# Altium schematic sheet jn5168_blk.SchDoc
size A4; Date: 1/11/2016; Engineer: JBayalas; DocumentNumber: 9; Revision: V2.0; SheetNumber: 9; SheetTotal: 10
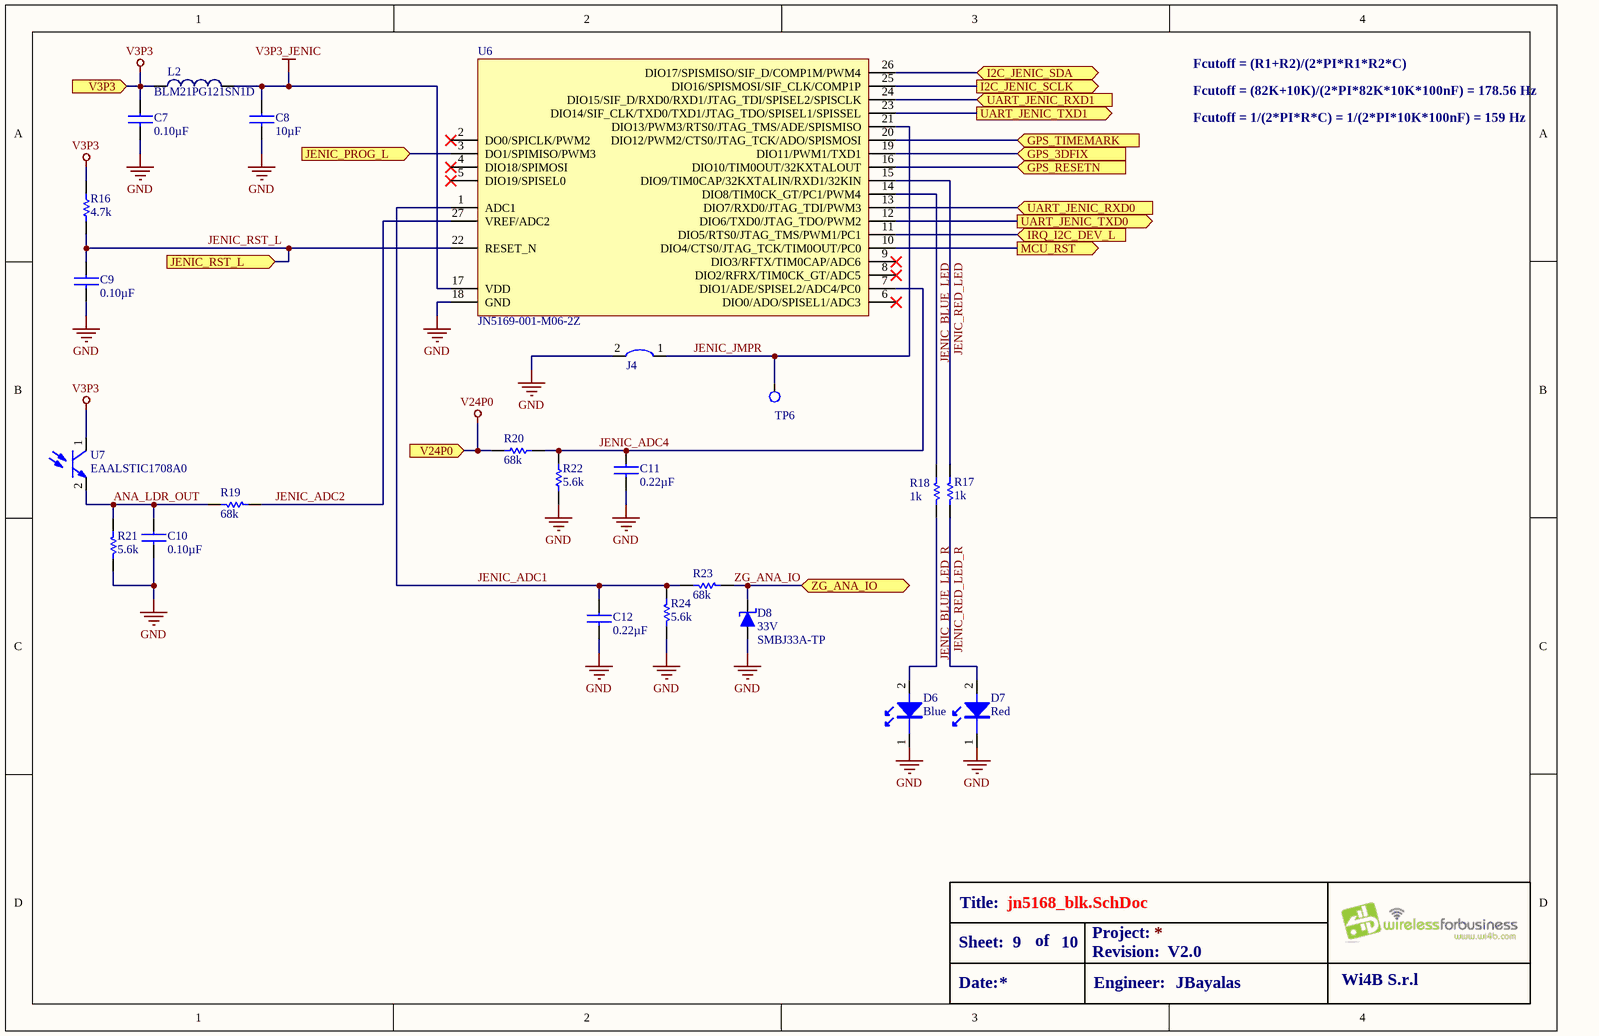
[diagram p0: jn5168_blk.SchDoc]

## Parts
C7  value 0.10µF  [C0402]  (hidden comment: GRM155R71H104ME14D)
C8  value 10µF  [C1206]  (hidden comment: GRM31CR71C106KAC7L)
C9  value 0.10µF  [C0402]  (hidden comment: GRM155R71H104ME14D)
C10  value 0.10µF  [C0402]  (hidden comment: GRM155R71H104ME14D)
C11  value 0.22µF  [C0603]  (hidden comment: GCM188R71H224KA64D)
C12  value 0.22µF  [C0603]  (hidden comment: GCM188R71H224KA64D)
D6  value Blue  [LED0402(BLUE)]  (hidden comment: VLMB1500-GS08)
D7  value Red  [LED0402(RED)]  (hidden comment: VLMS1500-GS08)
D8  RATING: 33V  [DO-214AA, SMB]  (hidden comment: SMBJ33A-TP)
J4  0603 Jumper  [0603 Jumper]  (value not drawn)
L2  BLM21PG121SN1D  [0805 INDUCTOR]
R16  value 4.7k  [R0402]  (hidden comment: MCS04020C4701FE000)
R17  value 1k  [R0402]  (hidden comment: MCS04020C1001FE000)
R18  value 1k  [R0402]  (hidden comment: MCS04020C1001FE000)
R19  value 68k  [R0603]  (hidden comment: ERA-3AEB683V)
R20  value 68k  [R0603]  (hidden comment: *)
R21  value 5.6k  [R0603]  (hidden comment: ERA-3AEB562V)
R22  value 5.6k  [R0603]  (hidden comment: *)
R23  value 68k  [R0603]  (hidden comment: ERA-3AEB683V)
R24  value 5.6k  [R0603]  (hidden comment: ERA-3AEB562V)
TP6  Test Point_2mm  [Test Point 2mm]  (value not drawn)
U6  JN5169-001-M06-2Z  [JN5168-001-M06Z]
U7  EAALSTIC1708A0  [EAALSTIC1708A0]

## Ports
GPS_3DFIX (in), GPS_RESETN (in), GPS_TIMEMARK (in), I2C_JENIC_SCLK (out), I2C_JENIC_SDA (bidir), IRQ_I2C_DEV_L (in), JENIC_PROG_L (in), JENIC_RST_L (in), MCU_RST (out), UART_JENIC_RXD0 (in), UART_JENIC_RXD1 (in), UART_JENIC_TXD0 (out), UART_JENIC_TXD1 (out), V3P3 (in), V24P0 (in), ZG_ANA_IO (bidir)

## Nets
GND: C7.2 C8.2 C9.2 C10.2 C11.2 C12.2 D6.1 D7.1 D8.2(A) J4.2 R21.1 R22.1 R24.1 U6.18(GND)
V3P3: C7.1 L2.2 R16.2 U7.1(COLLECTOR) ; port V3P3
V3P3_JENIC: C8.1 L2.1 U6.17(VDD)
V24P0: R20.1 ; port V24P0
ANA_LDR_OUT: C10.1 R19.2 R21.2 U7.2(EMITTER)
GPS_3DFIX: U6.19(DIO11/PWM1/TXD1) ; port GPS_3DFIX
GPS_RESETN: U6.16(DIO10/TIM0OUT/32KXTALOUT) ; port GPS_RESETN
GPS_TIMEMARK: U6.20(DIO12/PWM2/CTS0/JTAG_TCK/ADO/SPISMOSI) ; port GPS_TIMEMARK
I2C_JENIC_SCLK: U6.25(DIO16/SPISMOSI/SIF_CLK/COMP1P) ; port I2C_JENIC_SCLK
I2C_JENIC_SDA: U6.26(DIO17/SPISMISO/SIF_D/COMP1M/PWM4) ; port I2C_JENIC_SDA
IRQ_I2C_DEV_L: U6.11(DIO5/RTS0/JTAG_TMS/PWM1/PC1) ; port IRQ_I2C_DEV_L
JENIC_ADC1: C12.1 R23.2 R24.2 U6.1(ADC1)
JENIC_ADC2: R19.1 U6.27(VREF/ADC2)
JENIC_ADC4: C11.1 R20.2 R22.2 U6.7(DIO1/ADE/SPISEL2/ADC4/PC0)
JENIC_BLUE_LED: R18.2 U6.14(DIO8/TIM0CK_GT/PC1/PWM4)
JENIC_BLUE_LED_R: D6.2 R18.1
JENIC_JMPR: J4.1 TP6.1 U6.21(DIO13/PWM3/RTS0/JTAG_TMS/ADE/SPISMISO)
JENIC_PROG_L: U6.3(DO1/SPIMISO/PWM3) ; port JENIC_PROG_L
JENIC_RED_LED: R17.2 U6.15(DIO9/TIM0CAP/32KXTALIN/RXD1/32KIN)
JENIC_RED_LED_R: D7.2 R17.1
JENIC_RST_L: C9.1 R16.1 U6.22(RESET_N) ; port JENIC_RST_L
MCU_RST: U6.10(DIO4/CTS0/JTAG_TCK/TIM0OUT/PC0) ; port MCU_RST
UART_JENIC_RXD0: U6.13(DIO7/RXD0/JTAG_TDI/PWM3) ; port UART_JENIC_RXD0
UART_JENIC_RXD1: U6.24(DIO15/SIF_D/RXD0/RXD1/JTAG_TDI/SPISEL2/SPISCLK) ; port UART_JENIC_RXD1
UART_JENIC_TXD0: U6.12(DIO6/TXD0/JTAG_TDO/PWM2) ; port UART_JENIC_TXD0
UART_JENIC_TXD1: U6.23(DIO14/SIF_CLK/TXD0/TXD1/JTAG_TDO/SPISEL1/SPISSEL) ; port UART_JENIC_TXD1
ZG_ANA_IO: D8.1(K) R23.1 ; port ZG_ANA_IO

Not connected (* = marked no-connect by the designer): U6 2(DO0/SPICLK/PWM2)* 4(DIO18/SPIMOSI)* 5(DIO19/SPISEL0)* 6(DIO0/ADO/SPISEL1/ADC3)* 8(DIO2/RFRX/TIM0CK_GT/ADC5)* 9(DIO3/RFTX/TIM0CAP/ADC6)*

## Notes on the sheet
- Fcutoff = (R1+R2)/(2*PI*R1*R2*C)
- Fcutoff = (82K+10K)/(2*PI*82K*10K*100nF) = 178.56 Hz
- Fcutoff = 1/(2*PI*R*C) = 1/(2*PI*10K*100nF) = 159 Hz
- Title:
- Sheet:
- Date:
- of
- Project:
- Revision:
- Engineer:
- Wi4B S.r.l

## Library data of the parts
C7 C9 C10 = GRM155R71H104ME14D: CAP CER 0.1UF 50V X7R 0402; MFT: Murata Electronics North America; TYPE: SMD; FUNCTION: JN5168; MPN: GRM155R71H104ME14D; RATING: 50V; DNP: *
C8 = GRM31CR71C106KAC7L: CAP CER 10UF 16V X7R 1206; MFT: Murata Electronics North America; TYPE: SMD; FUNCTION: JN5168; MPN: GRM31CR71C106KAC7L; RATING: 16V; DNP: *
C11 C12 = GCM188R71H224KA64D: CAP CER 0.22UF 50V X7R 0603; MFT: Murata Electronics North America; TYPE: Surface Mount, MLCC; FUNCTION: analog inputs; MPN: GCM188R71H224KA64D; RATING: 50V
D6 = VLMB1500-GS08: LED BLUE 0402 SMD; MFT: Vishay Semiconductor Opto Division; FUNCTION: Top; MPN: VLMB1500-GS08; TYPE: SMD; RATING: *; DNP: *
D7 = VLMS1500-GS08: LED RED 0402 SMD; MFT: Vishay Semiconductor Opto Division; FUNCTION: Top; MPN: VLMS1500-GS08; TYPE: SMD; RATING: *; DNP: *
D8 = SMBJ33A-TP: TVS DIODE 33VWM 53.3VC SMB; MFT: Micro Commercial Co; FUNCTION: analog inputs; TYPE: Surface Mount; VALUE: SMBJ33A-TP; MPN: SMBJ33A-TP
J4 = 0603 Jumper: FUNCTION: JN5168
L2 = BLM21PG121SN1D: FERRITE CHIP 120 OHM 0805; MFT: Murata Electronics North America; RATING: 3A; TYPE: Surface Mount; VALUE: 120 Ohm; FUNCTION: JN5168; MPN: BLM21PG121SN1D
R16 = MCS04020C4701FE000: RES SMD 4.7K OHM 1% 1/10W 0402; MFT: Vishay Beyschlag; FUNCTION: JN5168; MPN: MCS04020C4701FE000; TYPE: SMD; RATING: 1/10W; DNP: *
R17 R18 = MCS04020C1001FE000: RES SMD 1K OHM 1% 1/10W 0402; MFT: Vishay Beyschlag; FUNCTION: Top; MPN: MCS04020C1001FE000; TYPE: SMD; RATING: 1/10W; DNP: *
R19 R23 = ERA-3AEB683V: RES SMD 68K OHM 0.1% 1/10W 0603; MFT: Panasonic Electronic Components; FUNCTION: analog inputs; MPN: ERA-3AEB683V; TYPE: SMD; RATING: 1/10W; DNP: *
R20 = ERA-3AEB683V: RES SMD 68K OHM 0.1% 1/10W 0603; MFT: Panasonic Electronic Components; MPN: ERA-3AEB683V; TYPE: SMD; RATING: 1/10W; LOAD: *
R21 R24 = ERA-3AEB562V: RES SMD 5.6K OHM 0.1% 1/10W 0603; MFT: Panasonic Electronic Components; FUNCTION: analog inputs; MPN: ERA-3AEB562V; TYPE: SMD; RATING: 1/10W; DNP: *
R22 = ERA-3AEB562V: RES SMD 5.6K OHM 0.1% 1/10W 0603; MFT: Panasonic Electronic Components; MPN: ERA-3AEB562V; TYPE: SMD; RATING: 1/10W; LOAD: *
TP6 = Test Point_2mm: Test Point 2mm
U6 = JN5169-001-M06-2Z: JN5169-001-M06-2 ZIGBEE 3.0, ZIG; MFT: NXP USA Inc.; VALUE: JN5169-001-M06-2Z; TYPE: SMD; RATING: *; LOAD: *; MPN: JN5169-001-M06-2Z
U7 = EAALSTIC1708A0: Ambient Light Sensors Analog Sensor - SMD 630nm; MFT: Everlight; LOAD: *; TYPE: SMD; RATING: *; VALUE: EAALSTIC1708A0; MPN: EAALSTIC1708A0